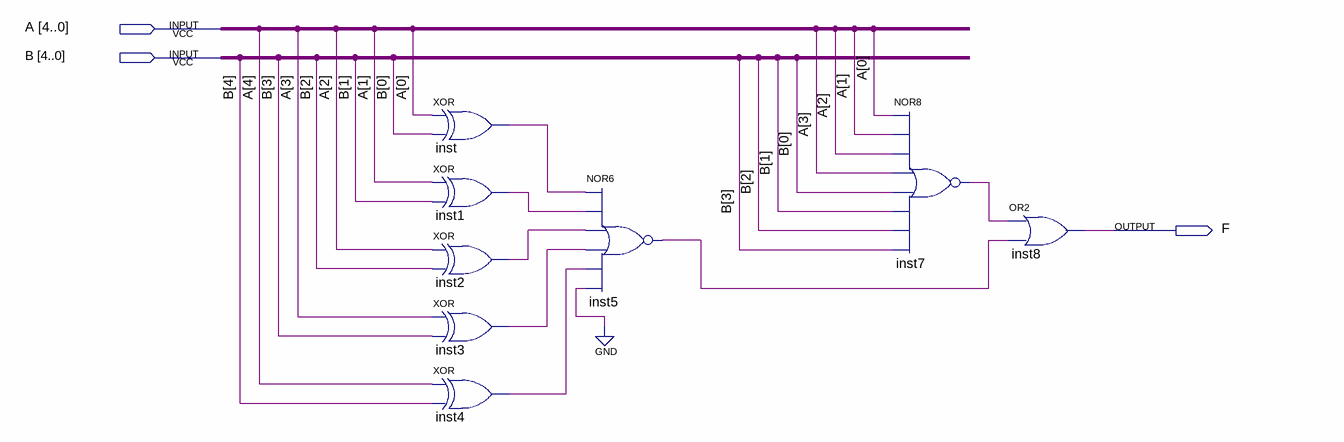
[diagram p0: schematic sheet]
// Quartus schematic igual5sign.bdf as structural Verilog: 8 symbols, 3 pins
module igual5sign (
  input  [4:0] A,
  input  [4:0] B,
  output F
);

  wire inst1_out, inst2_out, inst3_out, inst4_out, inst5_out, inst7_out, inst_out;

  xor inst (inst_out, A[0], B[0]);
  xor inst1 (inst1_out, A[1], B[1]);
  xor inst2 (inst2_out, A[2], B[2]);
  xor inst3 (inst3_out, A[3], B[3]);
  xor inst4 (inst4_out, A[4], B[4]);
  nor inst5 (inst5_out, inst_out, inst1_out, inst2_out, inst3_out, inst4_out, 1'b0);
  nor inst7 (inst7_out, A[0], A[1], A[2], A[3], B[0], B[1], B[2], B[3]);
  or inst8 (F, inst7_out, inst5_out);
endmodule
